# Altium schematic sheet Drive.SchDoc
size A3
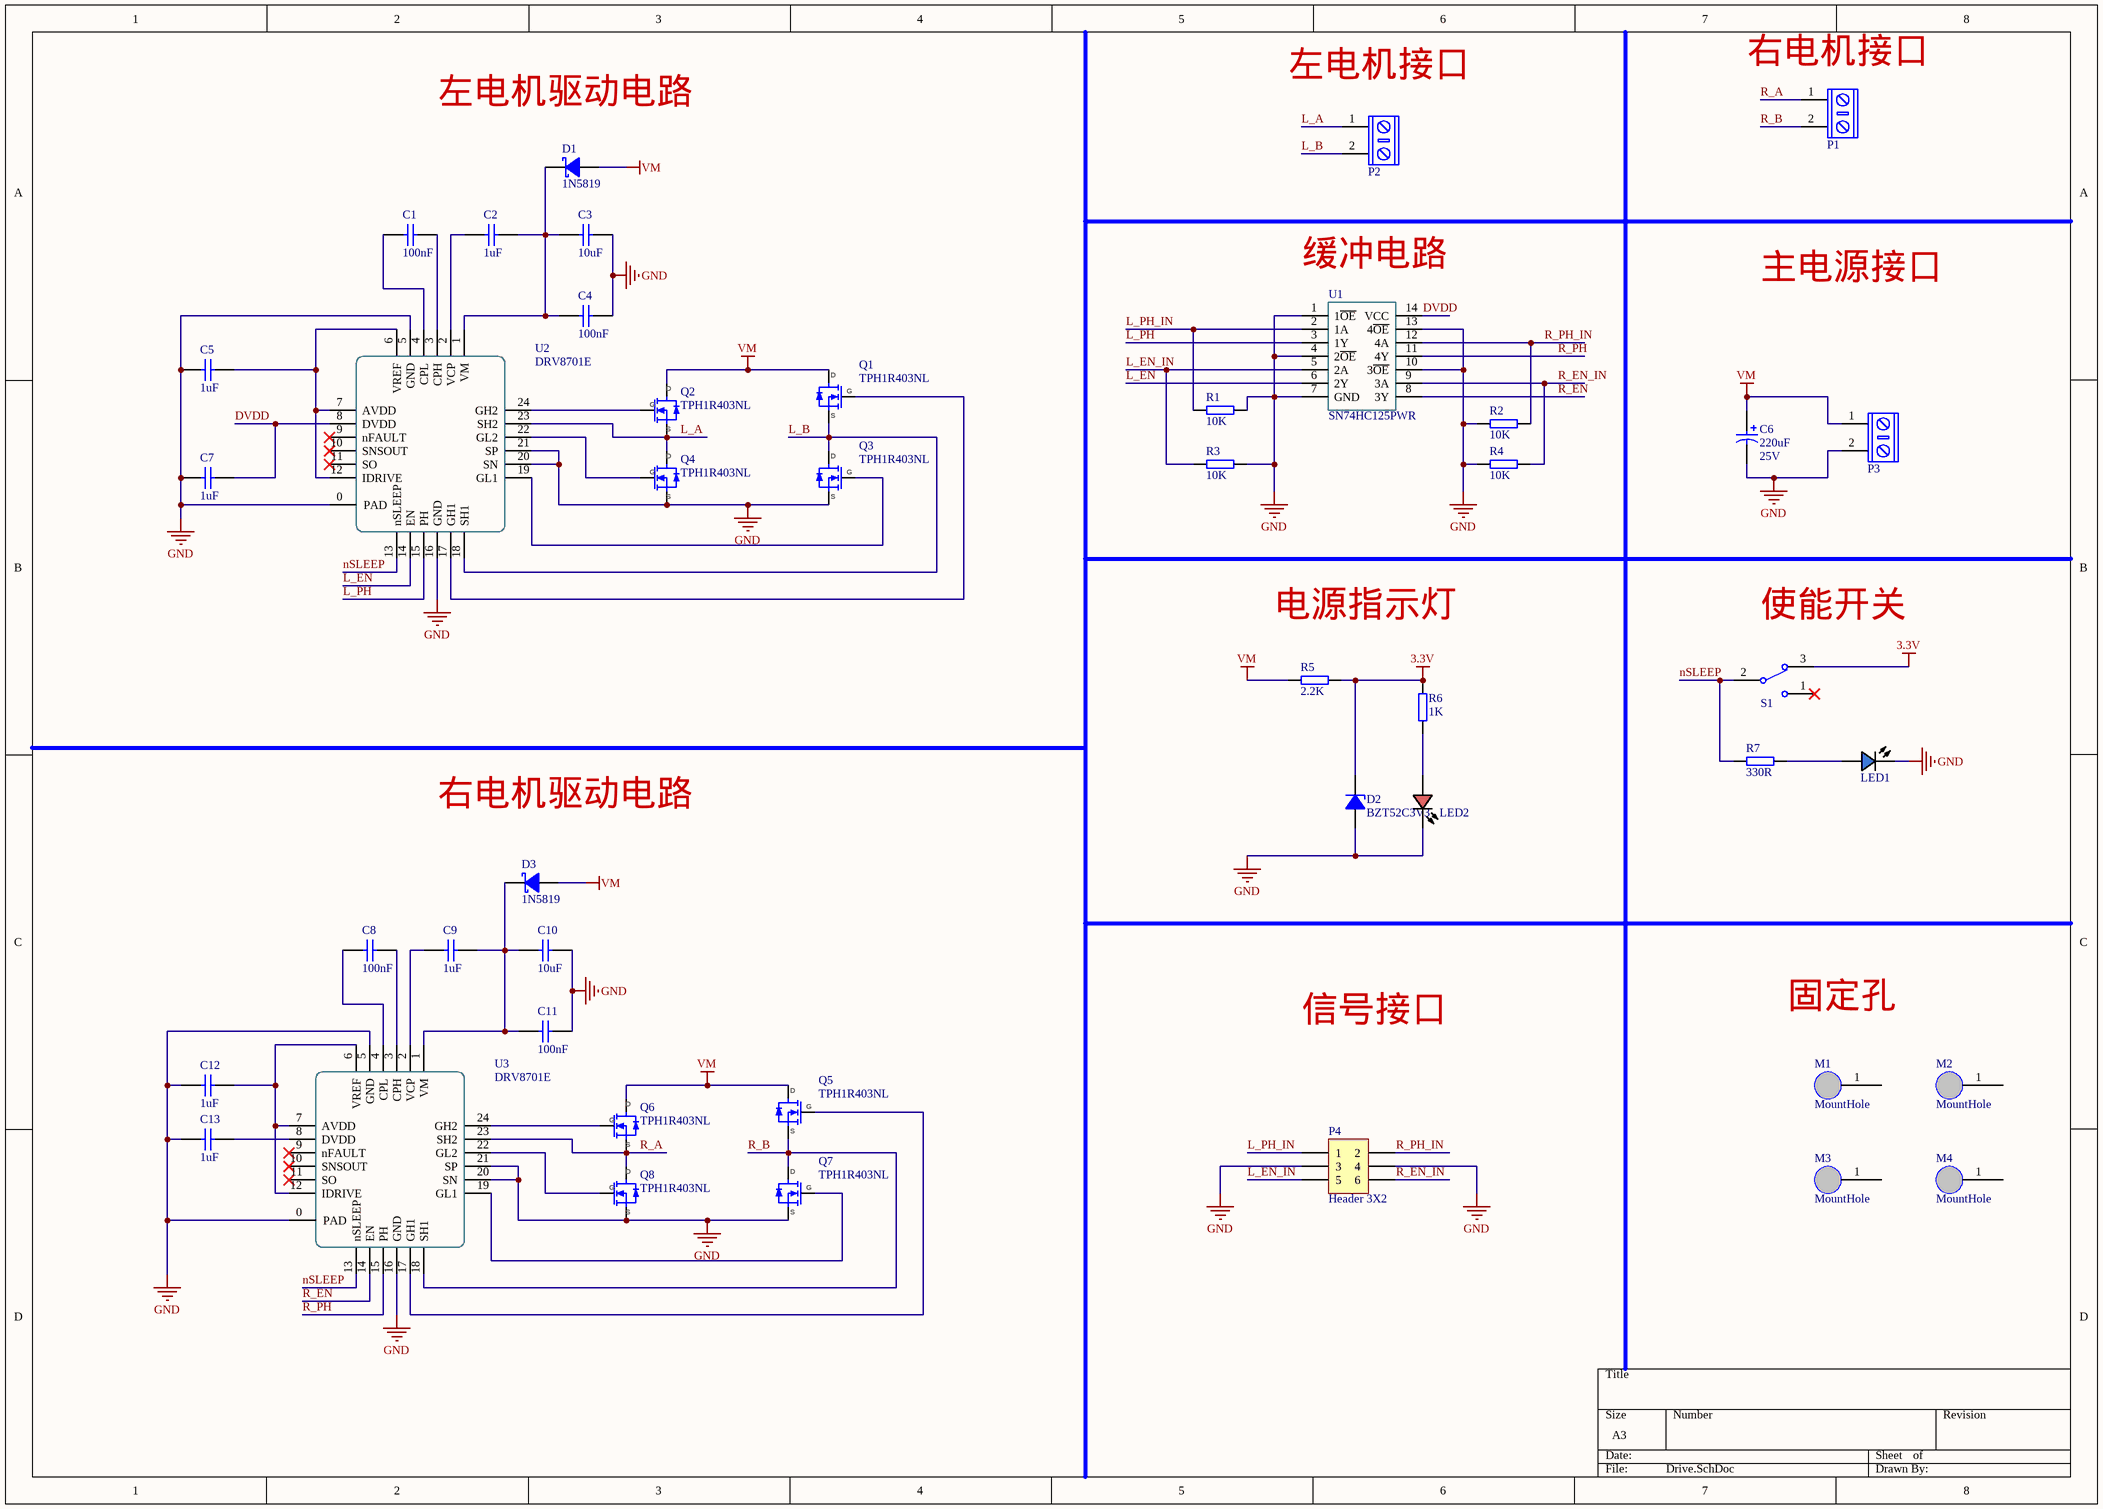
[diagram p0: Drive.SchDoc]

## Parts
C1  value 100nF  [CAPC1608[0603]S-N]  (hidden comment: 100nF ±10% 50V)
C2  value 1uF  [CAPC1608[0603]S-N]  (hidden comment: 1uF ±10% 25V)
C3  value 10uF  [CAPC1608[0603]S-N]  (hidden comment: 10uF ±10% 25V)
C4  value 100nF  [CAPC1608[0603]S-N]  (hidden comment: 100nF ±10% 50V)
C5  value 1uF  [CAPC1608[0603]S-N]  (hidden comment: 1uF ±10% 25V)
C6  value 220uF  Voltage: 25V  [CAPS6.3]  (hidden comment: 220uF 25V)
C7  value 1uF  [CAPC1608[0603]S-N]  (hidden comment: 1uF ±10% 25V)
C8  value 100nF  [CAPC1608[0603]S-N]  (hidden comment: 100nF ±10% 50V)
C9  value 1uF  [CAPC1608[0603]S-N]  (hidden comment: 1uF ±10% 25V)
C10  value 10uF  [CAPC1608[0603]S-N]  (hidden comment: 10uF ±10% 25V)
C11  value 100nF  [CAPC1608[0603]S-N]  (hidden comment: 100nF ±10% 50V)
C12  value 1uF  [CAPC1608[0603]S-N]  (hidden comment: 1uF ±10% 25V)
C13  value 1uF  [CAPC1608[0603]S-N]  (hidden comment: 1uF ±10% 25V)
D1  1N5819  [SOD-123-L]
D2  BZT52C3V3  [SOD-123-L]
D3  1N5819  [SOD-123-L]
LED1  Blue  [LEDC1608(0603)]  (value not drawn)
LED2  (no value)  [LEDC1608(0603)]
M1  MountHole  [M3-MountSlot]  (no BOM)
M2  MountHole  [M3-MountSlot]  (no BOM)
M3  MountHole  [M3-MountSlot]  (no BOM)
M4  MountHole  [M3-MountSlot]  (no BOM)
P1  KF/WJ/DG 30x connecter  [KF/WJ/DG 301-2p-5.0mm]  (value not drawn)
P2  KF/WJ/DG 30x connecter  [KF/WJ/DG 301-2p-5.0mm]  (value not drawn)
P3  KF/WJ/DG 30x connecter  [KF/WJ/DG 301-2p-5.0mm]  (value not drawn)
P4  Header 3X2  [HDR2X3]
Q1  TPH1R403NL  [DFN5x6]
Q2  TPH1R403NL  [DFN5x6]
Q3  TPH1R403NL  [DFN5x6]
Q4  TPH1R403NL  [DFN5x6]
Q5  TPH1R403NL  [DFN5x6]
Q6  TPH1R403NL  [DFN5x6]
Q7  TPH1R403NL  [DFN5x6]
Q8  TPH1R403NL  [DFN5x6]
R1  value 10K  [RESC1608[0603]S-N]  (hidden comment: 10K ±1%)
R2  value 10K  [RESC1608[0603]S-N]  (hidden comment: 10K ±1%)
R3  value 10K  [RESC1608[0603]S-N]  (hidden comment: 10K ±1%)
R4  value 10K  [RESC1608[0603]S-N]  (hidden comment: 10K ±1%)
R5  value 2.2K  [RESC1608[0603]S-N]  (hidden comment: 2.2K ±1%)
R6  value 1K  [RESC1608[0603]S-N]  (hidden comment: 1K ±1%)
R7  value 330R  [RESC1608[0603]S-N]  (hidden comment: 330R ±1%)
S1  SW-SPDT  [SS12D10]  (value not drawn)
U1  SN74HC125PWR  [TSSOP-14]
U2  DRV8701E  [QFN24-4x4]
U3  DRV8701E  [QFN24-4x4]

## Nets
3.3V: D2.K R5.2 R6.2 S1.3
GND: C3.2 C4.2 C5.1 C6.2 C7.1 C10.2 C11.2 C12.1 C13.1 D2.A LED1.C LED2.C P3.2 P4.3 P4.4 Q3.3(S) Q4.3(S) Q7.3(S) Q8.3(S) R1.2 R2.1 R3.2 R4.1 U1.1(1~{OE}) U1.4(2~{OE}) U1.7(GND) U1.10(3~{OE}) U1.13(4~{OE}) U2.0(PAD) U2.5(GND) U2.16(GND) U2.20(SN) U2.21(SP) U3.0(PAD) U3.5(GND) U3.16(GND) U3.20(SN) U3.21(SP)
VM: C6.1 D1.A D3.A P3.1 Q1.1(D) Q2.1(D) Q5.1(D) Q6.1(D) R5.1
DVDD: C7.2 U1.14(VCC) U2.8(DVDD)
L_A: P2.1 Q2.3(S) Q4.1(D) U2.23(SH2)
L_B: P2.2 Q1.3(S) Q3.1(D) U2.18(SH1)
L_EN: U1.6(2Y) U2.14(EN)
L_EN_IN: P4.5 R3.1 U1.5(2A)
L_PH: U1.3(1Y) U2.15(PH)
L_PH_IN: P4.1 R1.1 U1.2(1A)
nSLEEP: R7.1 S1.2 U2.13(nSLEEP) U3.13(nSLEEP)
R_A: P1.1 Q6.3(S) Q8.1(D) U3.23(SH2)
R_B: P1.2 Q5.3(S) Q7.1(D) U3.18(SH1)
R_EN: U1.8(3Y) U3.14(EN)
R_EN_IN: P4.6 R4.2 U1.9(3A)
R_PH: U1.11(4Y) U3.15(PH)
R_PH_IN: P4.2 R2.2 U1.12(4A)
NetC1_1: C1.1 U2.4(CPL)
NetC1_2: C1.2 U2.3(CPH)
NetC2_1: C2.1 U2.2(VCP)
NetC2_2: C2.2 C3.1 C4.1 D1.K U2.1(VM)
NetC5_2: C5.2 U2.6(VREF) U2.7(AVDD) U2.12(IDRIVE)
NetC8_1: C8.1 U3.4(CPL)
NetC8_2: C8.2 U3.3(CPH)
NetC9_1: C9.1 U3.2(VCP)
NetC9_2: C9.2 C10.1 C11.1 D3.K U3.1(VM)
NetC12_2: C12.2 U3.6(VREF) U3.7(AVDD) U3.12(IDRIVE)
NetC13_2: C13.2 U3.8(DVDD)
NetLED1_A: LED1.A R7.2
NetLED2_A: LED2.A R6.1
NetQ1_2: Q1.2(G) U2.17(GH1)
NetQ2_2: Q2.2(G) U2.24(GH2)
NetQ3_2: Q3.2(G) U2.19(GL1)
NetQ4_2: Q4.2(G) U2.22(GL2)
NetQ5_2: Q5.2(G) U3.17(GH1)
NetQ6_2: Q6.2(G) U3.24(GH2)
NetQ7_2: Q7.2(G) U3.19(GL1)
NetQ8_2: Q8.2(G) U3.22(GL2)

Not connected (* = marked no-connect by the designer): M1 1; M2 1; M3 1; M4 1; S1 1*; U2 9(nFAULT)* 10(SNSOUT)* 11(SO)*; U3 9(nFAULT)* 10(SNSOUT)* 11(SO)*

## Notes on the sheet
- 左电机驱动电路
- (near P2) 左电机接口
- (near P1) 右电机接口
- (near U1) 缓冲电路
- 主电源接口
- 电源指示灯
- (near S1) 使能开关
- 右电机驱动电路
- 信号接口
- 固定孔

## Library data of the parts
C1 C4 C8 C11 = Cap-Chip_1: 贴片电容; Published: 8-Jun-2000; Revision: July-2002: Re-released for DXP Platform.; Publisher: Altium Limited; Price(RMB): 0.000; Voltage: 50V; Tolerance: ±10%
C2 C5 C7 C9 C12 C13 = Cap-Chip_2: 贴片电容; Published: 8-Jun-2000; Revision: July-2002: Re-released for DXP Platform.; Publisher: Altium Limited; Price(RMB): 0.000; Voltage: 25V; Tolerance: ±10%
C3 C10 = Cap-Chip: 贴片电容; Published: 8-Jun-2000; Revision: July-2002: Re-released for DXP Platform.; Publisher: Altium Limited; Price(RMB): 0.000; Voltage: 25V; Tolerance: ±10%
C6 = Cap-Elect: Polarized Capacitor (Radial); Published: 8-Jun-2000; Revision: July-2002: Re-released for DXP Platform.; Publisher: Altium Limited; Price(RMB): 0.000
D1 D3 = Diode Schottky: 肖特基二极管 Diode; Imax: 500mA; Published: 8-Jun-2000; Revision: July-2002: Re-released for DXP Platform.; Publisher: Altium Limited; Price(RMB): 0.000; PartNumber: 1N5819
D2 = Diode Zen: 3.3V稳压二极管 SOD-123; Published: 8-Jun-2000; Revision: July-2002: Re-released for DXP Platform.; Publisher: Altium Limited; Price(RMB): 0.000
LED1 = LED Chip Blue: Typical Chip LED; Published: 8-Jun-2000; Revision: July-2002: Re-released for DXP Platform.; Publisher: Altium Limited; Price(RMB): 0.00; Color: Blue
LED2 = LED Chip Red: Typical Chip LED; Published: 8-Jun-2000; Revision: July-2002: Re-released for DXP Platform.; Publisher: Altium Limited; Price(RMB): 0.00
M1-M4 = MountHole: 固定孔
P1-P3 = KF/WJ/DG 30x: 接线端子 2Pin
P4 = Header 3X2: Header, 3-Pin, Dual row; LatestRevisionDate: 17-Jul-2002; LatestRevisionNote: Re-released for DXP Platform.; Publisher: Altium Limited; Price(RMB): 0.00
Q1-Q8 = TPH1R403NL: 东芝 N沟 MOS
R1-R4 = Res-Chip_1: 贴片电阻; Published: 8-Jun-2000; Revision: July-2002: Re-released for DXP Platform.; Publisher: Altium Limited; Price(RMB): 0.000; Tolerance: ±1%
R5 = Res-Chip: 贴片电阻; Published: 8-Jun-2000; Revision: July-2002: Re-released for DXP Platform.; Publisher: Altium Limited; Price(RMB): 0.000; Tolerance: ±1%
R6 = Res-Chip_2: 贴片电阻; Published: 8-Jun-2000; Revision: July-2002: Re-released for DXP Platform.; Publisher: Altium Limited; Price(RMB): 0.000; Tolerance: ±1%
R7 = Res-Chip_3: 贴片电阻; Published: 8-Jun-2000; Revision: July-2002: Re-released for DXP Platform.; Publisher: Altium Limited; Price(RMB): 0.000; Tolerance: ±1%
S1 = SW-SPDT: 单刀双掷开关 3脚船型、钮子、拨动开关 SPDT Subminiature Toggle Switch; Published: 24-Mar-1999; Publisher: Altium Limited; Price(RMB): 0.000
U1 = SN74HC125PWR: 三态输出的四路缓冲器 TSSOP-20
U2 U3 = DRV8701E: DRV8701E Ti全桥驱动芯片